# EAGLE design eeZeePot (EAGLE 7.1.0)
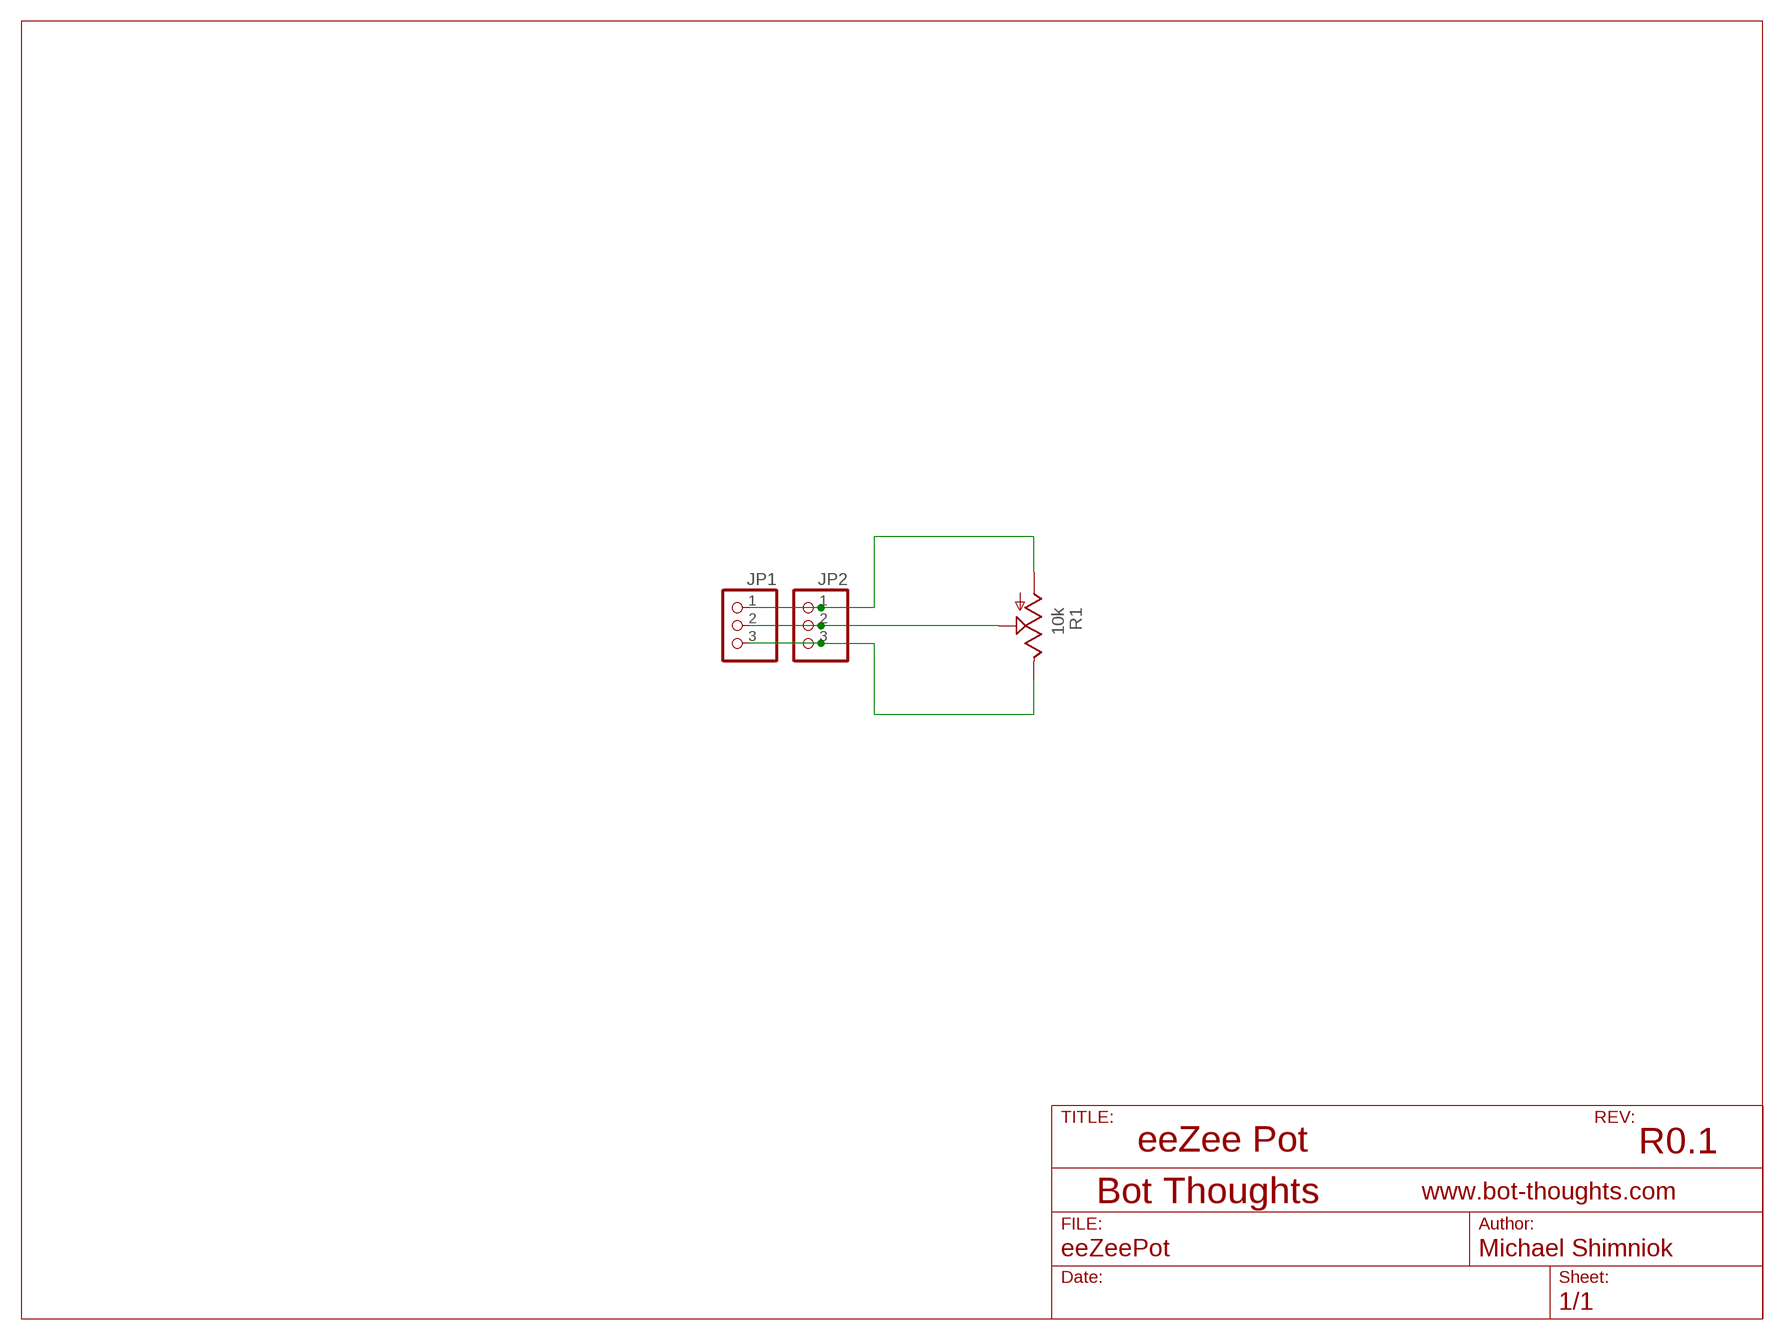
[diagram p0: schematic, sheet 1]

## Parts
JP1  PINHD-1X03_2.54-S  [1X03-S]
JP2  PINHD-1X03_2.54-S  [1X03-S]
R1  10k  TRIM_US-CA6V  [CA6V]

## Nets
N$1: JP1.1 JP2.1 R1.A
N$2: JP1.2 JP2.2 R1.S
N$3: JP1.3 JP2.3 R1.E

## Notes on the sheet
- eeZee Pot | R0.1

## Library data of the parts
JP1 JP2 = pinhead-2:PINHD-1X03: PIN HEADER
R1 = pot:TRIM_US-: POTENTIOMETER

## Board
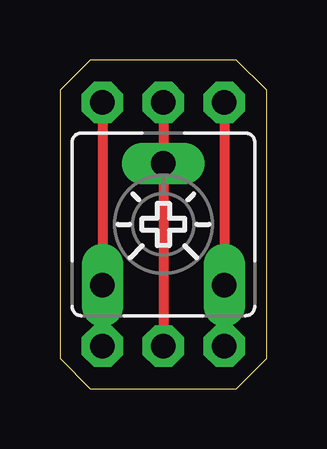
[diagram p1: board, top side]
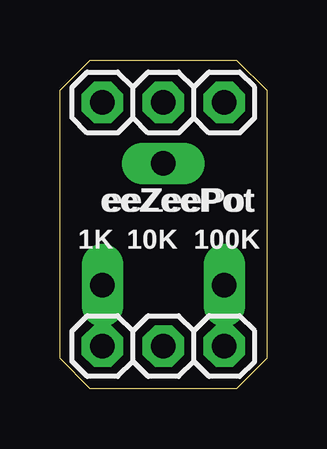
[diagram p2: board, bottom side, seen from below]

Size 8.64 x 13.72 mm. Coordinates in mm from the lower left corner, seen from the top.
Outline: 0,12.45 0,1.27 1.27,0 7.37,0 8.64,1.27 8.64,12.45 7.37,13.72 1.27,13.72 0,12.45
Copper layers (1*16): Top 0.0356mm / dielectric 1.5011mm / Bottom 0.0356mm
Design rules "LaenPCBOrder *": minimum track width 6mil, minimum drill 13mil, track to track 10mil, track to pad 10mil, pad to pad 10mil, via to via 10mil, smd to smd 8mil, copper to edge 10mil, drill to drill 10mil, minimum pad ring 7mil, minimum via ring 7mil, stop-mask expansion 3mil, vias tented up to drill 20mil, thermal gap 10mil

### Footprints (pad centres in the part's own frame; a part is rotated, then mirrored left to right if it is on the bottom)
1X03-S = drill 1.016 octagon: 1 -2.54,0; 2 0,0; 3 2.54,0
CA6V = drill 1.016 long: A -2.54,-2.54; E 2.54,-2.54; S 0,2.54

### Placement (x,y rotation side)
JP1  4.32,11.94 180 bottom
JP2  4.32,1.78 180 bottom
R1  4.32,6.86 0 top

### Tracks (layer width: path | path; a pad name or v marks a point on that pad's centre or on a via)
N$1
  Top 0.406: JP1.1 R1.A JP2.1
N$2
  Top 0.406: JP1.2 R1.S JP2.2
N$3
  Top 0.406: JP1.3 R1.E JP2.3

### Text on the board
bNames: eeZeePot | 100K | 10K | 1K
bsilk: eeZeePot | 100K | 10K | 1K